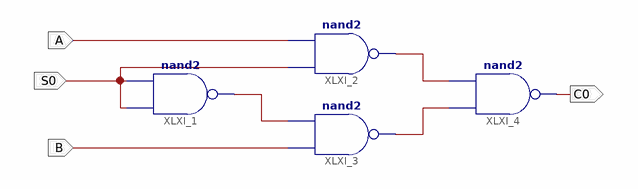
[diagram p0: schematic sheet 1]
// Xilinx ISE schematic OneBitMux.sch (spartan3e) as structural Verilog: 4 symbols, 4 ports
module OneBitMux (
  input  A,
  input  B,
  input  S0,
  output C0
);

  wire XLXN_2, XLXN_3, XLXN_4;

  nand XLXI_1 (XLXN_2, S0, S0);
  nand XLXI_2 (XLXN_3, S0, A);
  nand XLXI_3 (XLXN_4, B, XLXN_2);
  nand XLXI_4 (C0, XLXN_4, XLXN_3);
endmodule
